# Altium schematic sheet Skematik_Grader-GPS - v1.SchDoc
size A3
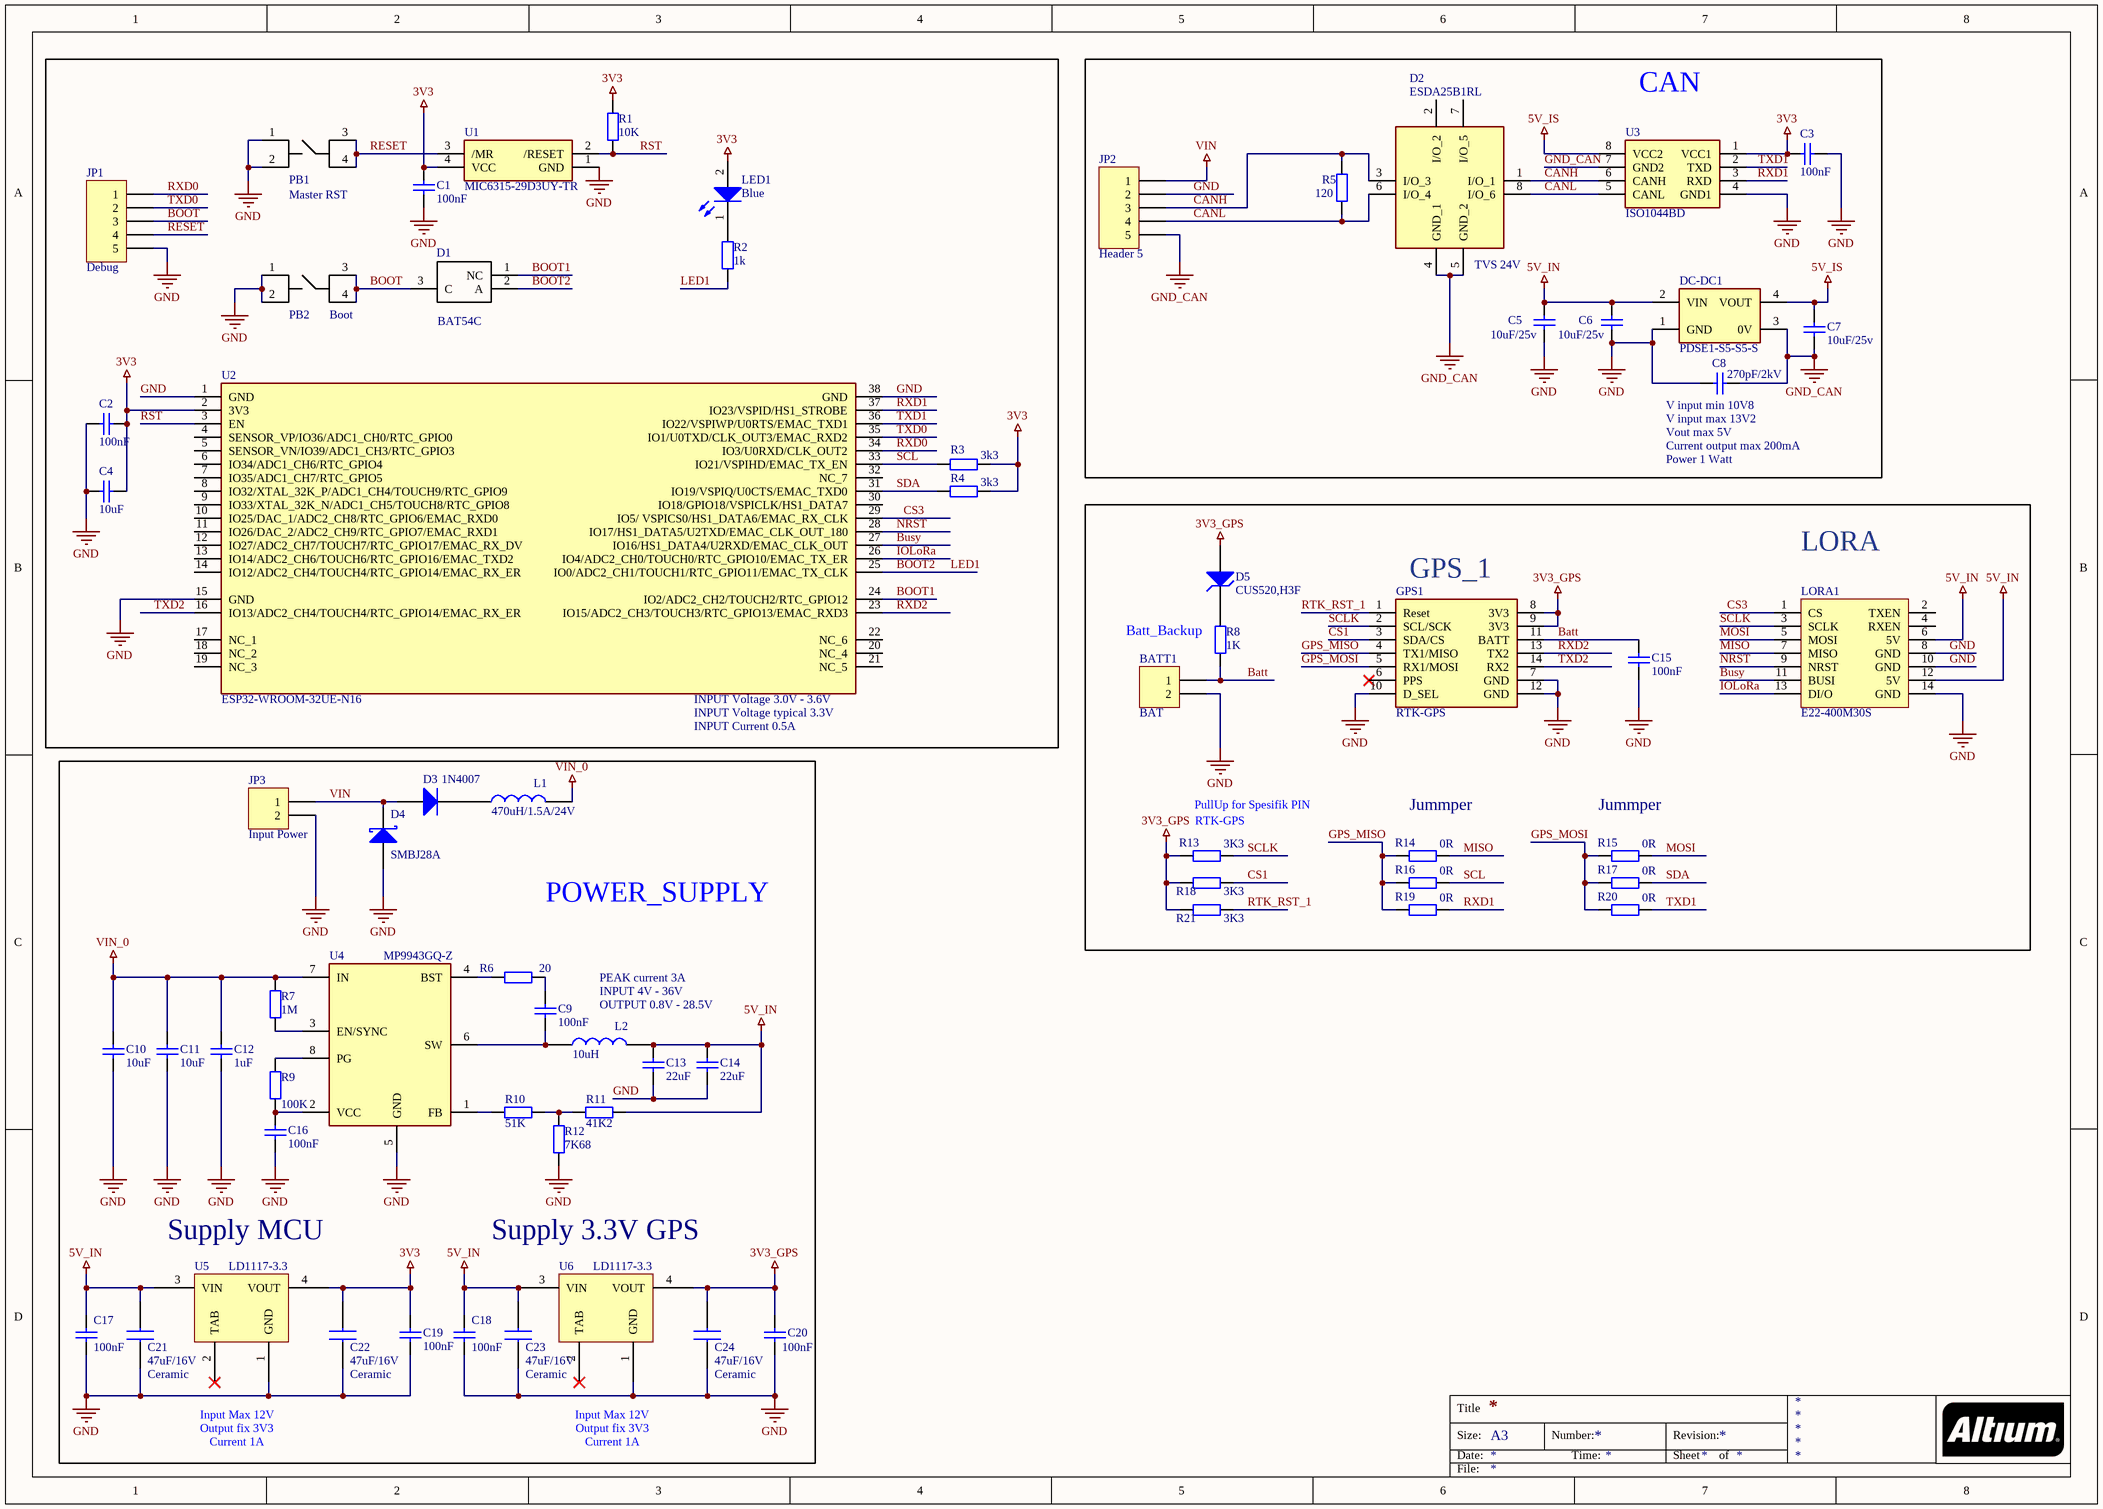
[diagram p0: Skematik_Grader-GPS - v1.SchDoc]

## Parts
BATT1  BAT  [CR1220]
C1  100nF  [CAPC2012X135N]
C2  100nF  [CAPC2012X135N]
C3  100nF  [CAPC2012X135N]
C4  10uF  [CAPC3216X100N]
C5  value 10uF/25v  [CAPC3216X180N]  (hidden comment: 10uF)
C6  value 10uF/25v  [CAPC3216X180N]  (hidden comment: 10uF)
C7  value 10uF/25v  [CAPC3216X100N]  (hidden comment: 2.2uF/25V)
C8  270pF/2kV  [CAPC3216X175N]
C9  100nF  [CAPC2012X135N]
C10  10uF  [CAPC3216X180N]
C11  10uF  [CAPC3216X180N]
C12  1uF  [CAPC2012X135N]
C13  22uF  [CAPC3216X180N]
C14  22uF  [CAPC3216X180N]
C15  100nF  [CAPC2012X135N]
C16  100nF  [CAPC2012X135N]
C17  100nF  [CAPC2012X135N]
C18  100nF  [CAPC2012X135N]
C19  100nF  [CAPC2012X135N]
C20  100nF  [CAPC2012X135N]
C21  47uF/16V  type: Ceramic  [CAPC3225X220N]
C22  47uF/16V  type: Ceramic  [CAPC3225X220N]
C23  47uF/16V  type: Ceramic  [CAPC3225X220N]
C24  47uF/16V  type: Ceramic  [CAPC3225X220N]
D1  BAT54C  [SC59-3]
D2  ESDA25B1RL  [SOIC127P600X175-8AN]
D3  1N4007  [DO-214AC]
D4  SMBJ28A  [DO-214AA]
D5  CUS520,H3F  [SOD323]
DC-DC1  PDSE1-S5-S5-S  [DC-DC]
GPS1  RTK-GPS  [ZED-F9P]
JP1  Debug  [HDR1X5]
JP2  Header 5  [Term_Block - 5P]
JP3  Input Power  [HDR1X2]
L1  470uH/1.5A/24V  [INDP9630X28N]
L2  10uH  [IND_5.4x5.3]
LED1  Blue  [LED-0805-A]
LORA1  E22-400M30S  [22s-V3]
PB1  Master RST  [PushButton1688]
PB2  Boot  [PushButton1688]
R1  10K  [RESC2012X70N]
R2  1k  [RESC2012X70N]
R3  3k3  [RESC2012X70N]
R4  3k3  [RESC2012X70N]
R5  120  [RESC2012X70N]
R6  20  [RESC2012X70N]
R7  1M  [RESC2012X70N]
R8  1K  [RESC2012X70N]
R9  100K  [RESC2012X70N]
R10  51K  [RESC2012X70N]
R11  41K2  [RESC2012X70N]
R12  7K68  [RESC2012X70N]
R13  3K3  [RESC2012X70N]
R14  0R  [RESC2012X70N]
R15  0R  [RESC2012X70N]
R16  0R  [RESC2012X70N]
R17  0R  [RESC2012X70N]
R18  3K3  [RESC2012X70N]
R19  0R  [RESC2012X70N]
R20  0R  [RESC2012X70N]
R21  3K3  [RESC2012X70N]
U1  MIC6315-29D3UY-TR  [MIC631529D3UYTR]
U2  ESP32-WROOM-32UE-N16  [ESP32WROOM32UEN16]
U3  ISO1044BD  [SOIC127P600X175-8AN]
U4  MP9943GQ-Z  [MP9943GQz-smd]
U5  LD1117-3.3  [TO-252]
U6  LD1117-3.3  [TO-252]

## Blocks framed on the sheet
CAN: C3 C5-C8 D2 DC-DC1 JP2 R5 U3

## Nets
3V3: C1.1 C2.2 C3.1 C4.2 C19.2 C22.1 LED1.2(A) R1.1 R3.1 R4.1 U1.4(VCC) U2.2(3V3) U3.1(VCC1) U5.4(VOUT)
3V3_GPS: C20.2 C24.1 D5.1(A) GPS1.8(3V3) GPS1.9(3V3) R13.1 R18.2 R21.2 U6.4(VOUT)
5V_IN: C5.2 C6.2 C13.2 C14.2 C17.2 C18.2 C21.1 C23.1 DC-DC1.2(VIN) L2.2 LORA1.6(5V) LORA1.12(5V) R11.1 U5.3(VIN) U6.3(VIN)
5V_IS: C7.1 DC-DC1.4(VOUT) U3.8(VCC2)
GND: BATT1.2 C1.2 C2.1 C3.2 C4.1 C5.1 C6.1 C8.1 C10.1 C11.1 C12.1 C13.1 C14.1 C15.1 C16.1 C17.1 C18.1 C19.1 C20.1 C21.2 C22.2 C23.2 C24.2 D4.1(A) DC-DC1.1(GND) GPS1.7(GND) GPS1.10(D_SEL) GPS1.12(GND) JP1.5 JP2.2 JP3.2 LORA1.8(GND) LORA1.10(GND) LORA1.14(GND) PB1.1 PB1.2 PB2.1 PB2.2 R12.2 U1.1(GND) U2.1(GND) U2.15(GND) U2.38(GND) U3.4(GND1) U4.5(GND) U5.1(GND) U6.1(GND)
GND_CAN: C7.2 C8.2 D2.4(GND_1) D2.5(GND_2) DC-DC1.3(0V) JP2.5 U3.7(GND2)
VIN: D3.1(A) D4.2(K) JP2.1 JP3.1
VIN_0: C10.2 C11.2 C12.2 L1.2 R7.2 U4.7(IN)
Batt: BATT1.1 C15.2 GPS1.11(BATT) R8.1
BOOT: D1.3(C) JP1.3 PB2.3 PB2.4
BOOT1: D1.1(NC) U2.24(IO2/ADC2_CH2/TOUCH2/RTC_GPIO12)
BOOT2: D1.2(A) R2.2 U2.25(IO0/ADC2_CH1/TOUCH1/RTC_GPIO11/EMAC_TX_CLK)  [also labelled LED1]
Busy: LORA1.11(BUSI) U2.27(IO16/HS1_DATA4/U2RXD/EMAC_CLK_OUT)
CANH: D2.1(I/O_1) D2.3(I/O_3) JP2.3 R5.1 U3.6(CANH)
CANL: D2.6(I/O_4) D2.8(I/O_6) JP2.4 R5.2 U3.5(CANL)
CS1: GPS1.3(SDA/CS) R18.1
CS3: LORA1.1(CS) U2.29(IO5/_VSPICS0/HS1_DATA6/EMAC_RX_CLK)
GPS_MISO: GPS1.4(TX1/MISO) R14.1 R16.1 R19.1
GPS_MOSI: GPS1.5(RX1/MOSI) R15.1 R17.1 R20.1
IOLoRa: LORA1.13(DI/O) U2.26(IO4/ADC2_CH0/TOUCH0/RTC_GPIO10/EMAC_TX_ER)
MISO: LORA1.7(MISO) R14.2
MOSI: LORA1.5(MOSI) R15.2
NRST: LORA1.9(NRST) U2.28(IO17/HS1_DATA5/U2TXD/EMAC_CLK_OUT_180)
RESET: JP1.4 PB1.3 PB1.4 U1.3(/MR)
RST: R1.2 U1.2(/RESET) U2.3(EN)
RTK_RST_1: GPS1.1(Reset) R21.1
RXD0: JP1.1 U2.34(IO3/U0RXD/CLK_OUT2)
RXD1: R19.2 U2.37(IO23/VSPID/HS1_STROBE) U3.3(RXD)
RXD2: GPS1.13(TX2) U2.23(IO15/ADC2_CH3/TOUCH3/RTC_GPIO13/EMAC_RXD3)
SCL: R3.2 R16.2 U2.33(IO21/VSPIHD/EMAC_TX_EN)
SCLK: GPS1.2(SCL/SCK) LORA1.3(SCLK) R13.2
SDA: R4.2 R17.2 U2.31(IO19/VSPIQ/U0CTS/EMAC_TXD0)
TXD0: JP1.2 U2.35(IO1/U0TXD/CLK_OUT3/EMAC_RXD2)
TXD1: R20.2 U2.36(IO22/VSPIWP/U0RTS/EMAC_TXD1) U3.2(TXD)
TXD2: GPS1.14(RX2) U2.16(IO13/ADC2_CH4/TOUCH4/RTC_GPIO14/EMAC_RX_ER)
NetC9_1: C9.1 L2.1 U4.6(SW)
NetC9_2: C9.2 R6.1
NetC16_2: C16.2 R9.1 U4.2(VCC)
NetD3_2: D3.2(K) L1.1
NetD5_2: D5.2(K) R8.2
NetLED1_1: LED1.1(K) R2.1
NetR6_2: R6.2 U4.4(BST)
NetR7_1: R7.1 U4.3(EN/SYNC)
NetR9_2: R9.2 U4.8(PG)
NetR10_1: R10.1 R11.2 R12.1
NetR10_2: R10.2 U4.1(FB)

Not connected (* = marked no-connect by the designer): D2 2(I/O_2) 7(I/O_5); GPS1 6(PPS)*; LORA1 2(TXEN) 4(RXEN); U2 4(SENSOR_VP/IO36/ADC1_CH0/RTC_GPIO0) 5(SENSOR_VN/IO39/ADC1_CH3/RTC_GPIO3) 6(IO34/ADC1_CH6/RTC_GPIO4) 7(IO35/ADC1_CH7/RTC_GPIO5) 8(IO32/XTAL_32K_P/ADC1_CH4/TOUCH9/RTC_GPIO9) 9(IO33/XTAL_32K_N/ADC1_CH5/TOUCH8/RTC_GPIO8) 10(IO25/DAC_1/ADC2_CH8/RTC_GPIO6/EMAC_RXD0) 11(IO26/DAC_2/ADC2_CH9/RTC_GPIO7/EMAC_RXD1) 12(IO27/ADC2_CH7/TOUCH7/RTC_GPIO17/EMAC_RX_DV) 13(IO14/ADC2_CH6/TOUCH6/RTC_GPIO16/EMAC_TXD2) 14(IO12/ADC2_CH4/TOUCH4/RTC_GPIO14/EMAC_RX_ER) 17(NC_1) 18(NC_2) 19(NC_3) 20(NC_4) 21(NC_5) 22(NC_6) 30(IO18/GPIO18/VSPICLK/HS1_DATA7) 32(NC_7); U5 2(TAB)*; U6 2(TAB)*

## Notes on the sheet
- (near D2) TVS 24V
- (near C8) V input min 10V8
- (near C8) V input max 13V2
- Current output max 200mA
- (near C8) Vout max 5V
- Power 1 Watt
- (near GPS1) GPS_1
- LORA
- (near R8) Batt_Backup
- (near U2) INPUT Voltage 3.0V - 3.6V
- (near U2) INPUT Voltage typical 3.3V
- INPUT Current 0.5A
- (near R13) RTK-GPS
- (near R13) PullUp for Spesifik PIN
- (near R14) Jummper
- (near R15) Jummper
- POWER_SUPPLY
- PEAK current 3A
- INPUT 4V - 36V
- OUTPUT 0.8V - 28.5V
- (near U5) Supply MCU
- Supply 3.3V GPS
- Input Max 12V
- Output fix 3V3
- Current 1A
- Title
- Size:
- Date:
- A3
- Number:
- Time:
- Revision:
- Sheet
- of
- File:

## Library data of the parts
BATT1 = MHDR1X2: Header, 2-Pin; LatestRevisionDate: 17-Jul-2002; LatestRevisionNote: Re-released for DXP Platform.; Publisher: Altium Limited
C1-C20 = Cap: Capacitor; Published: 8-Jun-2000; LatestRevisionDate: 17-Jul-2002; LatestRevisionNote: Re-released for DXP Platform.; PackageReference: RAD-0.3; Publisher: Altium Limited; PackageDescription: Radial Cap, Thru-Hole; 2 Leads; 0.3 in Pin Spacing
  C1-C3 C9 C15-C20: Value: 100nF
  C4 C10 C11: Value: 10uF
  C8: Value: 270pF/2kV
  C12: Value: 1uF
  C13 C14: Value: 22uF
C21-C24 = KCM55WC71E107MH13L: Capacitor; Manufacturer_Name: Murata Electronics; Datasheet Link: https://psearch.en.murata.com/capacitor/product/KCM55WC71E107MH13%23.html; Height: 6.7mm; Manufacturer_Part_Number: KCM55WC71E107MH13L; Mouser Part Number: 81-KCM55WC71E107MH13; Mouser Price/Stock: https://www.mouser.co.uk/ProductDetail/Murata-Electronics/KCM55WC71E107MH13L/?qs=rrS6PyfT74chf2MiAK9y9w%3D%3D
D1 = RB420
D2 = ESDA25B1RL: TVS DIODA; Manufacturer_Name: STMicroelectronics; Datasheet Link: https://datasheet.datasheetarchive.com/originals/distributors/Datasheets-31/DSA-604715.pdf; Height: 1.75mm; Manufacturer_Part_Number: ESDA25B1RL; Mouser Part Number: 511-ESDA25B1-TR; Mouser Price/Stock: https://www.mouser.co.uk/ProductDetail/STMicroelectronics/ESDA25B1RL?qs=W9XpDeWYzcpfBY1EWDH0LA%3D%3D; Arrow Part Number: ESDA25B1RL; Arrow Price/Stock: https://www.arrow.com/en/products/esda25b1rl/stmicroelectronics?region=nac
D3 = Diode 1N4001: 1 Amp General Purpose Rectifier; Published: 8-Jun-2000; LatestRevisionDate: 17-Jul-2002; LatestRevisionNote: Re-released for DXP Platform.; DatasheetVersion: 1998; PackageVersion: Aug-1999; PackageReference: DO-41; Publisher: Altium Limited; PackageDescription: Diode, Axial; Body 5.2 x 2.7 mm (LxDia. max), Lead Dia. 0.86 mm (max); Code_JEDEC: DO-204-AL; ComponentLink1Description: Manufacturer Link; ComponentLink1URL: http://www.fairchildsemi.com/; ComponentLink2Description: Datasheet; ComponentLink2URL: http://www.fairchildsemi.com/ds/1N%2F1N4001.pdf
D4 = D Schottky: Schottky Diode; Published: 8-Jun-2000; LatestRevisionDate: 17-Jul-2002; LatestRevisionNote: Re-released for DXP Platform.; PackageReference: SMB; Publisher: Altium Limited; PackageDescription: DO-214-AA/SMB; 2 C-Bend Leads; Body 5.3 x 3.6 mm, inc. leads (LxW); Code_JEDEC: DO-214-AA
D5 = D Zener: Zener Diode; Published: 8-Jun-2000; LatestRevisionDate: 17-Jul-2002; LatestRevisionNote: Re-released for DXP Platform.; PackageReference: DIODE-0.7; Publisher: Altium Limited; PackageDescription: Diode, Thru-Hole; 2 Leads; 0.7 in Pin Spacing
DC-DC1 = PDSE1-S24-S12-S: DC-DC 24 to 12 / PDSE1-S24-S12-S
GPS1 = ZED-F9P: GPS Sensor
JP1 JP2 = Header 5: Header, 5-Pin; LatestRevisionDate: 17-Jul-2002; LatestRevisionNote: Re-released for DXP Platform.; Publisher: Altium Limited
JP3 = Header 2: Header, 2-Pin; LatestRevisionDate: 17-Jul-2002; LatestRevisionNote: Re-released for DXP Platform.; Publisher: Altium Limited
L1 L2 = MPL-AL5050-100: Inductor; Manufacturer_Name: Monolithic Power Systems (MPS); Datasheet Link: https://www.monolithicpower.com/en/documentview/productdocument/index/version/2/document_type/Datasheet/lang/en/sku/MPL-AL5050-100/document_id/5809/; Height: 5mm; Manufacturer_Part_Number: MPL-AL5050-100; Mouser Part Number: 946-MPL-AL5050-100; Mouser Price/Stock: https://www.mouser.co.uk/ProductDetail/Monolithic-Power-Systems-MPS/MPL-AL5050-100?qs=sPbYRqrBIVm5wy9Bi%2FiK%252BQ%3D%3D
LED1 = LED1: Typical Blue GaAs LED; Published: 8-Jun-2000; LatestRevisionDate: 08-Jul-2005; LatestRevisionNote: Mech Layer 1 removed.; PackageReference: LED-1; Publisher: Altium Limited; PackageDescription: LED; 2 Leads
LORA1 = Lora: Lora 22S / Lora 30S
PB1 PB2 = PB_SW_1
R1 R2 R5 R8 = Res2: Resistor; Value: 560; Published: 8-Jun-2000; LatestRevisionDate: 17-Jul-2002; LatestRevisionNote: Re-released for DXP Platform.; PackageReference: AXIAL-0.4; Publisher: Altium Limited; PackageDescription: Axial Device, Thru-Hole; 2 Leads; 0.4 in Pin Spacing
R3 R4 R6 R7 R9-R21 = Res2: Resistor; Published: 8-Jun-2000; LatestRevisionDate: 17-Jul-2002; LatestRevisionNote: Re-released for DXP Platform.; PackageReference: AXIAL-0.4; Publisher: Altium Limited; PackageDescription: Axial Device, Thru-Hole; 2 Leads; 0.4 in Pin Spacing
  R3 R4: Value: 3k3
  R6: Value: 20
  R7: Value: 1M
  R9: Value: 100K
  R10: Value: 51K
  R11: Value: 41K2
  R12: Value: 7K68
  R13 R18 R21: Value: 3K3
  R14-R17 R19 R20: Value: 0R
U1 = MIC6315-29D3UY-TR: Integrated Circuit; Manufacturer_Name: Microchip; Datasheet Link: http://ww1.microchip.com/downloads/en/devicedoc/mic6315.pdf; Height: 1.12mm; Manufacturer_Part_Number: MIC6315-29D3UY-TR; Mouser Part Number: 998-MIC6315-29D3UYTR; Mouser Price/Stock: https://www.mouser.co.uk/ProductDetail/Microchip-Technology-Micrel/MIC6315-29D3UY-TR?qs=Y3Q3JoKAO1RCG5WxNvIuAQ%3D%3D
U2 = ESP32-WROOM-32UE-N16A
U3 = ISO1044BD: Integrated Circuit; Manufacturer_Name: Texas Instruments; Datasheet Link: https://www.ti.com/lit/ds/symlink/iso1044.pdf?ts=1621674257443&ref_url=https%253A%252F%252Fwww.ti.com%252Fstore%252Fti%252Fen%252Fp%252Fproduct%252F%253Fp%253DISO1044BD; Height: 1.75mm; Manufacturer_Part_Number: ISO1044BD; Mouser Part Number: 595-ISO1044BD; Mouser Price/Stock: https://www.mouser.co.uk/ProductDetail/Texas-Instruments/ISO1044BD?qs=W%2FMpXkg%252BdQ6CUu0TGf8UTA%3D%3D; Arrow Part Number: ISO1044BD; Arrow Price/Stock: https://www.arrow.com/en/products/iso1044bd/texas-instruments?region=nac
U4 = MP9943GQ-Z: Integrated Circuit; Manufacturer_Name: Monolithic Power Systems (MPS); Datasheet Link: https://www.monolithicpower.com/jp/documentview/productdocument/index/version/2/document_type/Datasheet/lang/en/sku/MP9943/document_id/865/; Height: 1mm; Manufacturer_Part_Number: MP9943GQ-Z; Mouser Part Number: 946-MP9943GQ-Z; Mouser Price/Stock: https://www.mouser.co.uk/ProductDetail/Monolithic-Power-Systems-MPS/MP9943GQ-Z?qs=493kPxzlxfKVcyEndxwGRg%3D%3D
U5 U6 = LM1117-3.3V: AP2114D-3.3TRG1, 3.3V LDO Voltage Regulator